# EAGLE design cc2650_48 (EAGLE 8.3.2)
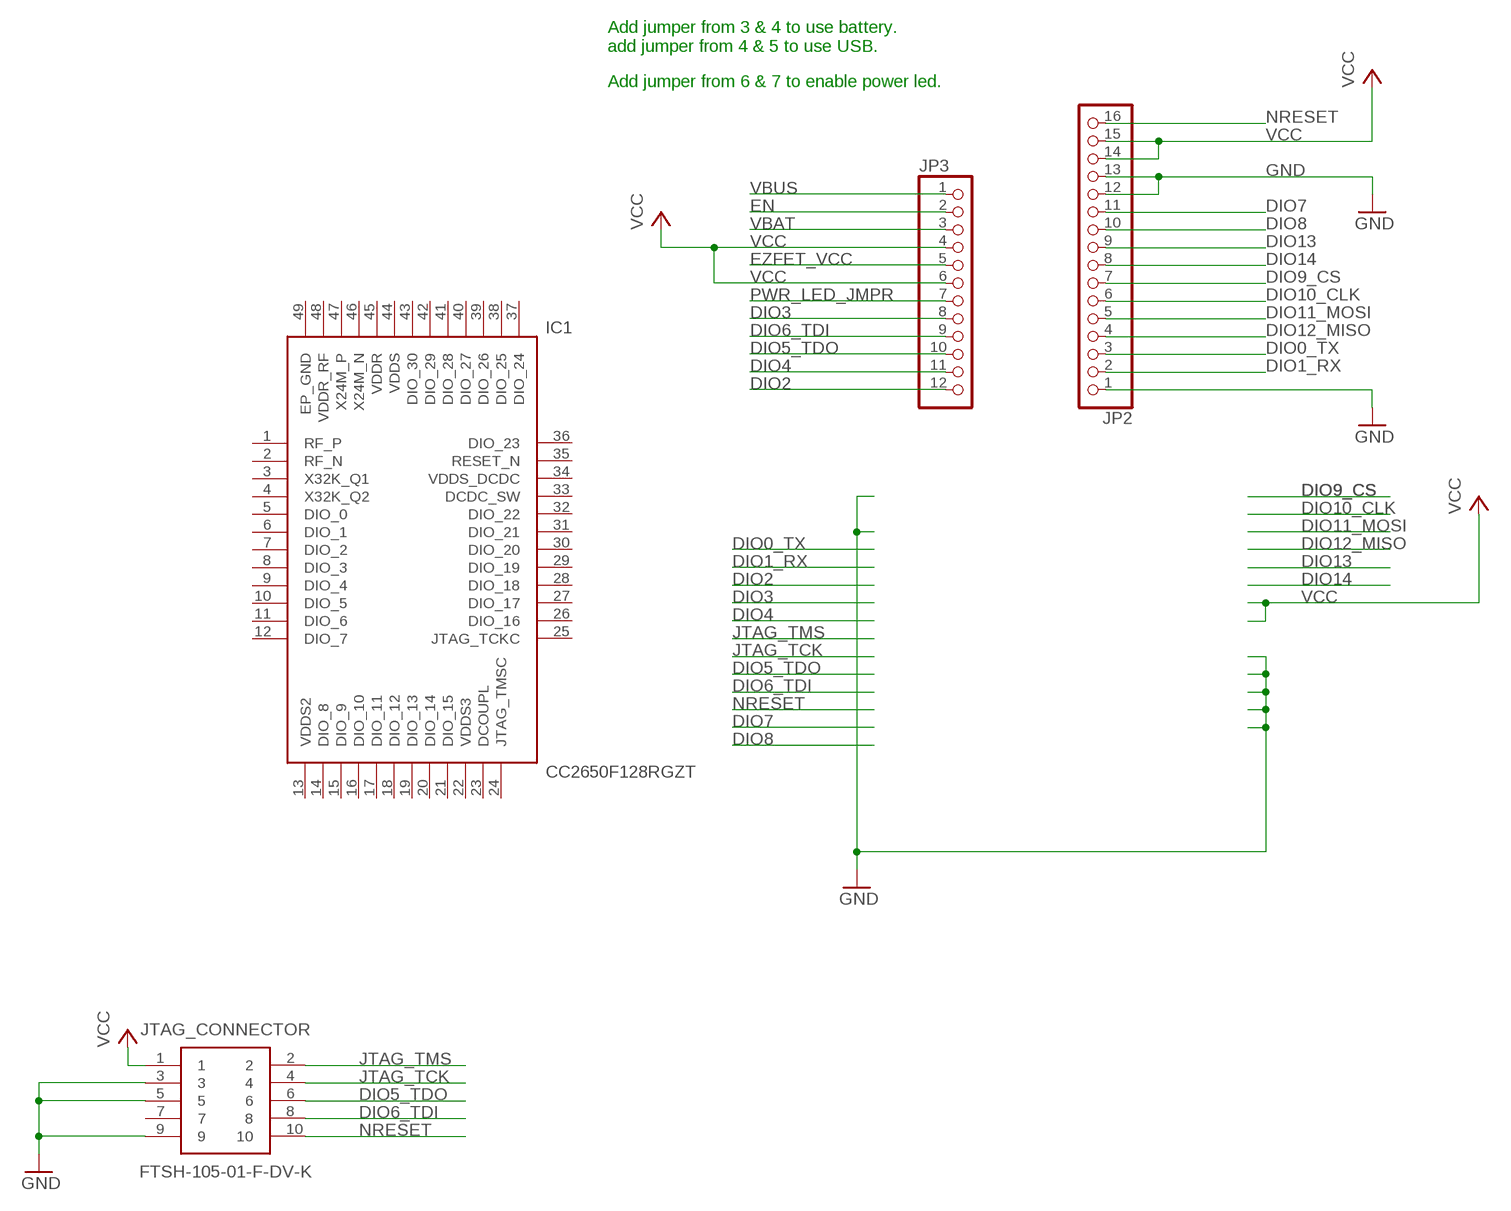
[diagram p0: schematic, sheet 1, part 1 of 2]
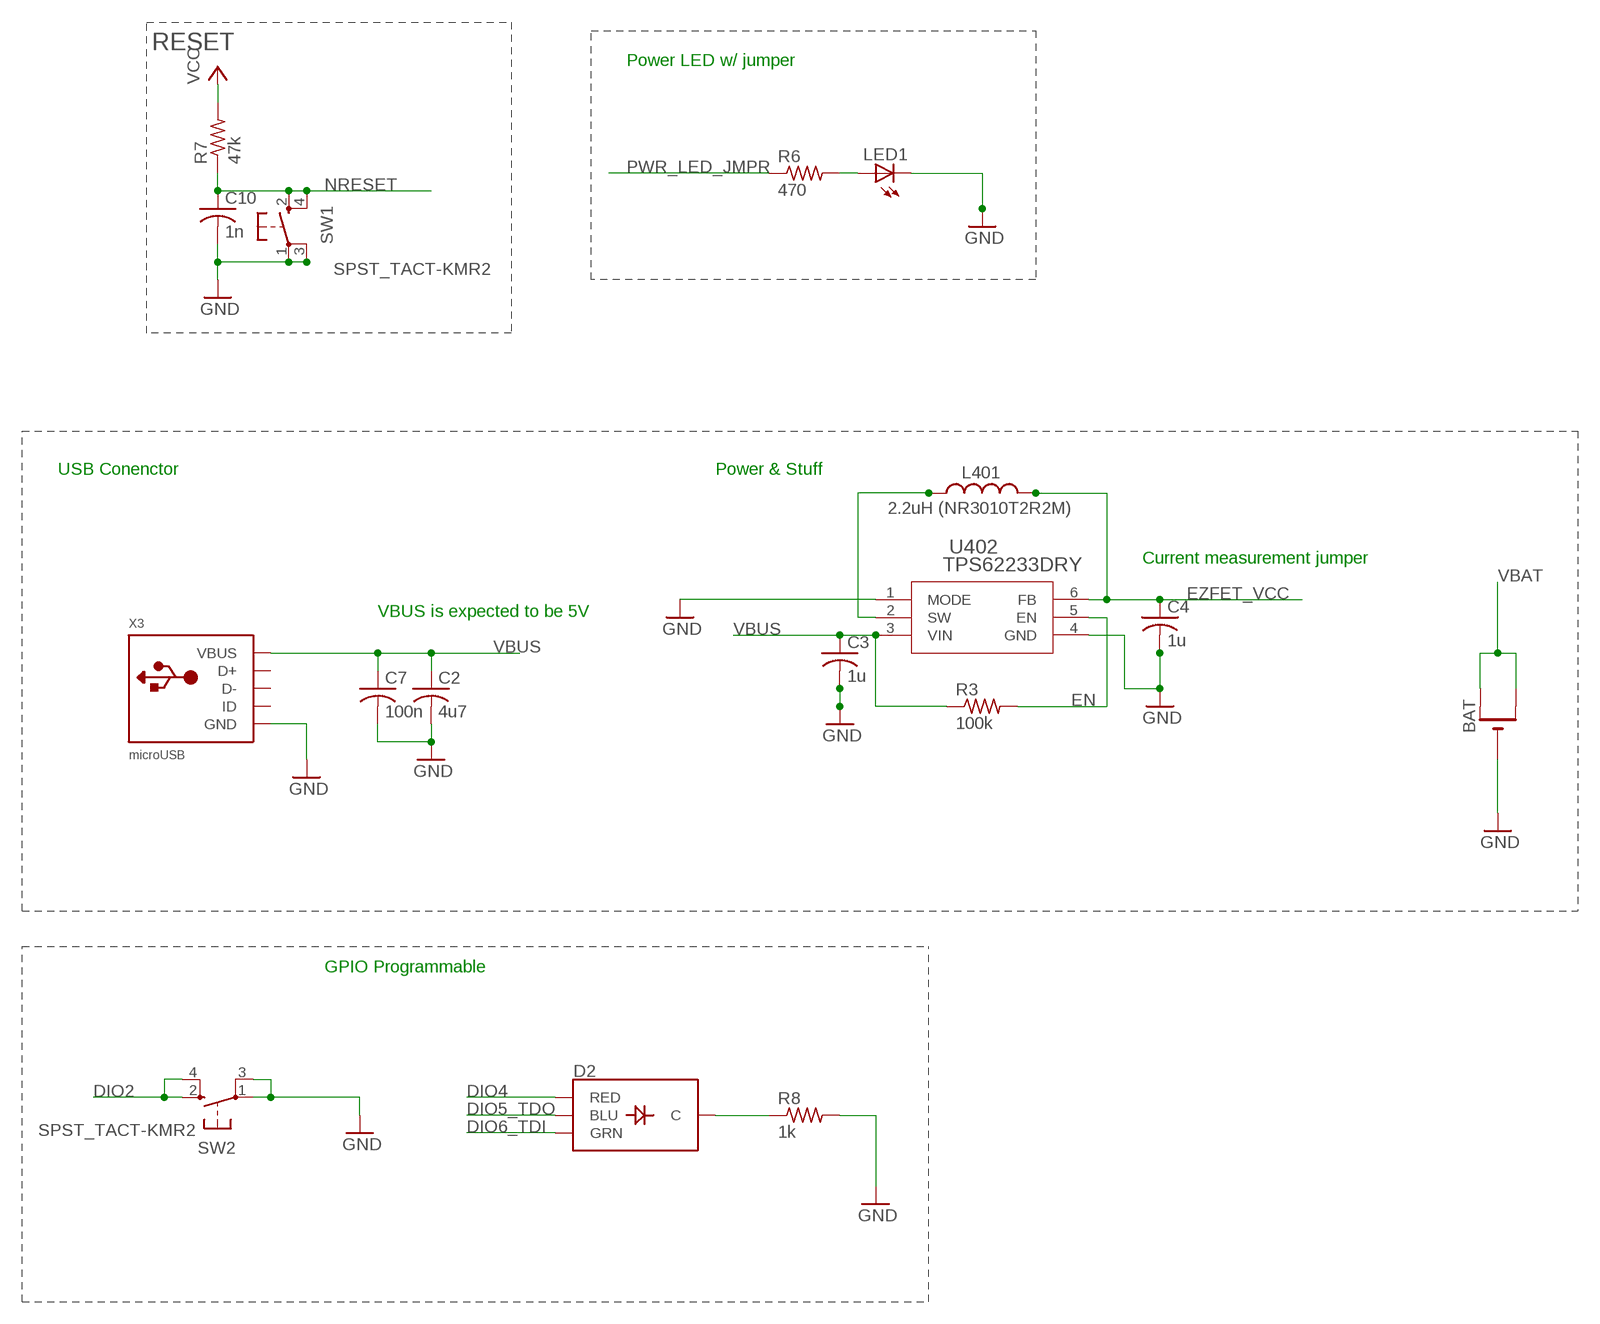
[diagram p1: schematic, sheet 1, part 2 of 2]

## Parts
BAT  CR1220THM  [CR1220-THM]
C2  4u7  C-USC1206  [C1206]
C3  1u  C-USC0805  [C0805]
C4  1u  C-USC0805  [C0805]
C7  100n  C-USC0805  [C0805]
C10  1n  C-USC0805  [C0805]
D2  LED-RGB-CCPIRANHA  [LED_PIRANHA_5MM]
IC1  CC2650F128RGZT  [QFN50P700X700X100-49N]
JP2  HEADER-1X16ROUND  [1X16_ROUND]
JP3  HEADER-1X12  [1X12_ROUND]
JTAG_CONNECTOR  FTSH-105-01-F-DV-K  [SAMTEC_FTSH-105-01-L-DV]
L401  2.2uH (NR3010T2R2M)  L-NR3010  [L-NR3010]
LED1  LEDCHIPLED_0805  [CHIPLED_0805]
R3  100k  R-US_R0805  [R0805]
R6  470  R-US_R0805  [R0805]
R7  47k  R-US_R0805  [R0805]
R8  1k  R-US_R0805  [R0805]
SW1  SPST_TACT-KMR2  [KMR2]
SW2  SPST_TACT-KMR2  [KMR2]
U402  TPS62233DRY  TPS6223X_DRY_6  [DRY6]
X3  microUSB  USB_MICRO_20329_V2  [4UCONN_20329_V2]

## Nets
DIO0_TX: JP2.3
DIO1_RX: JP2.2
DIO2: JP3.12 SW2.2(S) SW2.4(S1)
DIO3: JP3.8
DIO4: D2.R(RED) JP3.11
DIO5_TDO: D2.B(BLU) JP3.10 JTAG_CONNECTOR.6
DIO6_TDI: D2.G(GRN) JP3.9 JTAG_CONNECTOR.8
DIO7: JP2.11
DIO8: JP2.10
DIO9_CS: JP2.7
DIO10_CLK: JP2.6
DIO11_MOSI: JP2.5
DIO12_MISO: JP2.4
DIO13: JP2.9
DIO14: JP2.8
EN: JP3.2 R3.2 U402.5(EN)
EZFET_VCC: C4.1 JP3.5 L401.P$2 U402.6(FB)
GND: BAT.- C2.2 C3.2 C4.2 C7.2 C10.2 JP2.1 JP2.12 JP2.13 JTAG_CONNECTOR.3 JTAG_CONNECTOR.5 JTAG_CONNECTOR.9 LED1.C R8.2 SW1.1(P) SW1.3(P1) SW2.1(P) SW2.3(P1) U402.1(MODE) U402.4(GND) X3.BASE@1(GND) X3.BASE@2(GND) X3.GND X3.SPRT@1(GND) X3.SPRT@2(GND) X3.SPRT@3(GND) X3.SPRT@4(GND)
JTAG_TCK: JTAG_CONNECTOR.4
JTAG_TMS: JTAG_CONNECTOR.2
N$2: D2.-(C) R8.1
N$14: L401.P$1 U402.2(SW)
N$32: LED1.A R6.2
NRESET: C10.1 JP2.16 JTAG_CONNECTOR.10 R7.1 SW1.2(S) SW1.4(S1)
PWR_LED_JMPR: JP3.7 R6.1
VBAT: BAT.+1(+) BAT.+2(+1) JP3.3
VBUS [Power]: C2.1 C3.1 C7.1 JP3.1 R3.1 U402.3(VIN) X3.VBUS
VCC: JP2.14 JP2.15 JP3.4 JP3.6 JTAG_CONNECTOR.1 R7.2
Unconnected: IC1.1(RF_P) IC1.2(RF_N) IC1.3(X32K_Q1) IC1.4(X32K_Q2) IC1.5(DIO_0) IC1.6(DIO_1) IC1.7(DIO_2) IC1.8(DIO_3) IC1.9(DIO_4) IC1.10(DIO_5) IC1.11(DIO_6) IC1.12(DIO_7) IC1.14(DIO_8) IC1.15(DIO_9) IC1.16(DIO_10) IC1.17(DIO_11) IC1.18(DIO_12) IC1.19(DIO_13) IC1.20(DIO_14) IC1.21(DIO_15) IC1.23(DCOUPL) IC1.24(JTAG_TMSC) IC1.25(JTAG_TCKC) IC1.26(DIO_16) IC1.27(DIO_17) IC1.28(DIO_18) IC1.29(DIO_19) IC1.30(DIO_20) IC1.31(DIO_21) IC1.32(DIO_22) IC1.33(DCDC_SW) IC1.35(RESET_N) IC1.36(DIO_23) IC1.37(DIO_24) IC1.38(DIO_25) IC1.39(DIO_26) IC1.40(DIO_27) IC1.41(DIO_28) IC1.42(DIO_29) IC1.43(DIO_30) IC1.46(X24M_N) IC1.47(X24M_P) JTAG_CONNECTOR.7 X3.D+ X3.D- X3.ID

## Notes on the sheet
- RESET
- Power LED w/ jumper
- Add jumper from 3 & 4 to use battery.
  add jumper from 4 & 5 to use USB.
- Add jumper from 6 & 7 to enable power led.
- USB Conenctor | Power & Stuff
- Current measurement jumper
- VBUS is expected to be 5V
- GPIO Programmable

## Power pins joined to a net without a drawn wire
EP_GND: IC1.49(EP_GND)
VDDR: IC1.45(VDDR)
VDDR_RF: IC1.48(VDDR_RF)
VDDS: IC1.44(VDDS)
VDDS2: IC1.13(VDDS2)
VDDS3: IC1.22(VDDS3)
VDDS_DCDC: IC1.34(VDDS_DCDC)

## Library data of the parts
BAT = adafruit:CR1220: CR1216/CR1220/CR1225 12mm 3V lithium coin cell Great for battery packup. Both SMT and THM holders. Note the THM package has the ground pads on both sides of the PCB so that the masks are the same - this reduces the cost; MF: KEYSTONE ELECTR; MPN: 3000; OC_NEWARK: 66F5622
C2 = adafruit:C-US: CAPACITOR, American symbol; MPN: GRT31CC81E475KE01L; OC_NEWARK: 01AC8998
C3 C4 = adafruit:C-US: CAPACITOR, American symbol; MPN: C0805C105K5RACTU; OC_NEWARK: 05AC8016
C7 C10 = adafruit:C-US: CAPACITOR, American symbol
D2 = SparkFun-LED:LED-RGB-CC: LED-RGB Common Cathode Packages: LED RGB-THRU LED_PIRANHA_5MM SparkFun Products: RGB Diffused Common Cathode- Diffuse <[https://www.sparkfun.com/products/9264]> RGB Diffused Common Cathode - Clear <[https://www.sparkfun.com/products/105]> LED-RGB 5mm Square (Piranha) <[https://www.sparkfun.com/products/11679]>; MPN: CLMVB-FKA-CFHEHLCBB7A363; OC_NEWARK: 11X6434; SF_ID: COM-11679
IC1 = CC2650F128RGZT:CC2650F128RGZT: MCU 32-bit 128KB Flash 20K RAM VQFN48 Texas Instruments CC2650F128RGZT, 32bit ARM Cortex M3 Microcontroller, 48MHz, 128 kB Flash, 48-Pin VQFN <https://componentsearchengine.com/Images/1/CC2650F128RGZT.jpg> Source: Datasheet <http://www.ti.com/lit/ds/symlink/cc2650.pdf>; DESCRIPTION: MCU 32-bit 128KB Flash 20K RAM VQFN48 Texas Instruments CC2650F128RGZT, 32bit ARM Cortex M3 Microcontroller, 48MHz, 128 kB Flash, 48-Pin VQFN; HEIGHT: 1mm; MANUFACTURER_NAME: Texas Instruments; MANUFACTURER_PART_NUMBER: CC2650F128RGZT; RS_PART_NUMBER: 8751012P; SUPPLIER_NAME: RS
JP2 = microbuilder:HEADER-1X16: PIN HEADER; OC_NEWARK: unknown
JP3 = microbuilder:HEADER-1X12; OC_NEWARK: unknown
JTAG_CONNECTOR = FTSH-105-01-F-DV-K:FTSH-105-01-F-DV-K: .050 x .050 CL DOUBLE VERTICAL SMT TERMINAL STRIP <https://componentsearchengine.com/Images/9/FTSH-105-01-F-DV-K.jpg> Source: Datasheet <http://suddendocs.samtec.com/prints/ftsh-1xx-xx-xxx-dv-xxx-xxx-mkt.pdf>; DESCRIPTION: .050 x .050 CL DOUBLE VERTICAL SMT TERMINAL STRIP; HEIGHT: mm; MANUFACTURER_NAME: SAMTEC; MANUFACTURER_PART_NUMBER: FTSH-105-01-F-DV-K; MPN: FTSH-105-01-F-DV-K; OC_NEWARK: 45P5160; SUPPLIER_NAME: RS
L401 = MSP-EXP430F5659:L-NR3010; MPN: NR3010T2R2M; OC_NEWARK: 87K4752
LED1 = led:LED: LED OSRAM: - CHIPLED LG R971, LG N971, LY N971, LG Q971, LY Q971, LO R971, LY R971 LH N974, LH R974 LS Q976, LO Q976, LY Q976 LO Q996 - Hyper CHIPLED LW Q18S LB Q993, LB Q99A, LB R99A - SideLED LS A670, LO A670, LY A670, LG A670, LP A670 LB A673, LV A673, LT A673, LW A673 LH A674 LY A675 LS A676, LA A676, LO A676, LY A676, LW A676 LS A679, LY A679, LG A679 - Hyper Micro SIDELED® LS Y876, LA Y876, LO Y876, LY Y876 LT Y87S - SmartLED LW L88C, LW L88S LB L89C, LB L89S, LG L890 LS L89K, LO L89K, LY L89K LS L896, LA L896, LO L896, LY L896 - TOPLED LS T670, LO T670, LY T670, LG T670, LP T670 LSG T670, LSP T670, LSY T670, LOP T670, LYG T670 LG T671, LOG T671, LSG T671 LB T673, LV T673, LT T673, LW T673 LH T674 LS T676, LA T676, LO T676, LY T676, LB T676, LH T676, LSB T676, LW T676 LB T67C, LV T67C, LT T67C, LS T67K, LO T67K, LY T67K, LW E67C LS E67B, LA E67B, LO E67B, LY E67B, LB E67C, LV E67C, LT E67C LW T67C LS T679, LY T679, LG T679 LS T770, LO T770, LY T770, LG T770, LP T770 LB T773, LV T773, LT T773, LW T773 LH T774 LS E675, LA E675, LY E675, LS T675 LS T776, LA T776, LO T776, LY T776, LB T776 LHGB T686 LT T68C, LB T68C - Hyper Mini TOPLED® LB M676 - Mini TOPLED Santana® LG M470 LS M47K, LO M47K, LY M47K Source: http://www.osram.convergy.de LUXEON: - LUMILED® LXK2-PW12-R00, LXK2-PW12-S00, LXK2-PW14-U00, LXK2-PW14-V00 LXK2-PM12-R00, LXK2-PM12-S00, LXK2-PM14-U00 LXK2-PE12-Q00, LXK2-PE12-R00, LXK2-PE12-S00, LXK2-PE14-T00, LXK2-PE14-U00 LXK2-PB12-K00, LXK2-PB12-L00, LXK2-PB12-M00, LXK2-PB14-N00, LXK2-PB14-P00, LXK2-PB14-Q00 LXK2-PR12-L00, LXK2-PR12-M00, LXK2-PR14-Q00, LXK2-PR14-R00 LXK2-PD12-Q00, LXK2-PD12-R00, LXK2-PD12-S00 LXK2-PH12-R00, LXK2-PH12-S00 LXK2-PL12-P00, LXK2-PL12-Q00, LXK2-PL12-R00 Source: www.luxeon.com KINGBRIGHT: KA-3528ASYC Source: www.kingbright.com
R3 R6-R8 = adafruit:R-US_: RESISTOR, American symbol
SW1 SW2 = adafruit:SPST_TACT: SMT 6mm switch, EVQQ2 series http://www.ladyada.net/library/eagle; OC_NEWARK: unknown
U402 = tps62231dry:TPS6223X_DRY_6; DATASHEETURL: http://www.ti.com/lit/gpn/TPS62231; DESCRIPTION: 3 MHz Ultra Small Step Down Converter in 1x1.5 SON Package; FAMILY_NAME: STEP-DOWN REGULATOR; GENERIC_PART_NUMBER: TPS62231; INDUSTRY_STD_PKG_TYPE: SON; MANUFACTURER: Texas Instruments; MANUFACTURER_PART_NUMBER: tps62231_dry_6; MPN: TPS62233DRYT; OC_NEWARK: 37X8886; PACKAGE_DESIGNATOR: DRY; PIN_COUNT: 6; VALUE: TPS6223xDRY; VENDOR: Texas Instuments
X3 = microbuilder:USB: USB Connectors USBMINIB - Surface Mount Female Mini-B USB Connector 4UConnector: 06564

## Net classes
0 Default: width 0.203 mm, drill 0.305 mm, clearance 0.152 mm
1 Ground: width 0.203 mm, drill 0.305 mm, clearance 0.152 mm to class 0, clearance 0.152 mm
2 Power: width 0.203 mm, drill 0.305 mm, clearance 0.152 mm to class 0, clearance 0.152 mm to class 1, clearance 0.152 mm

## Board
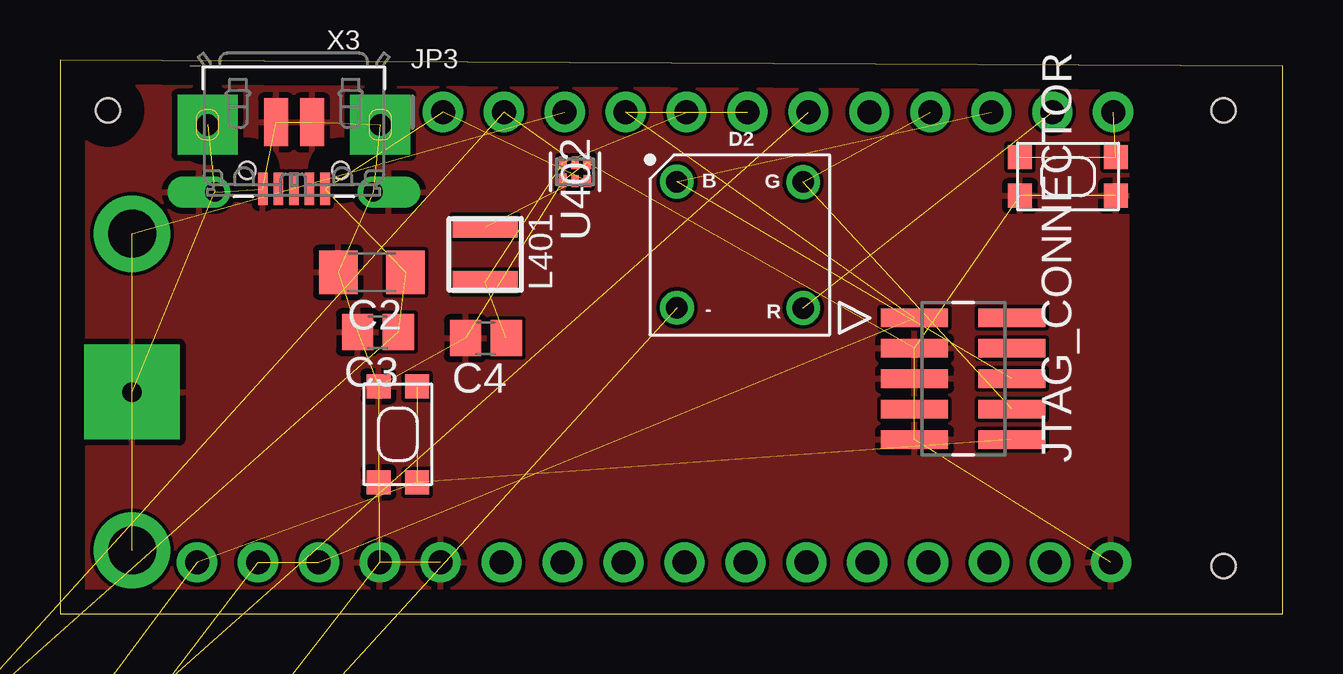
[diagram p2: board, top side]
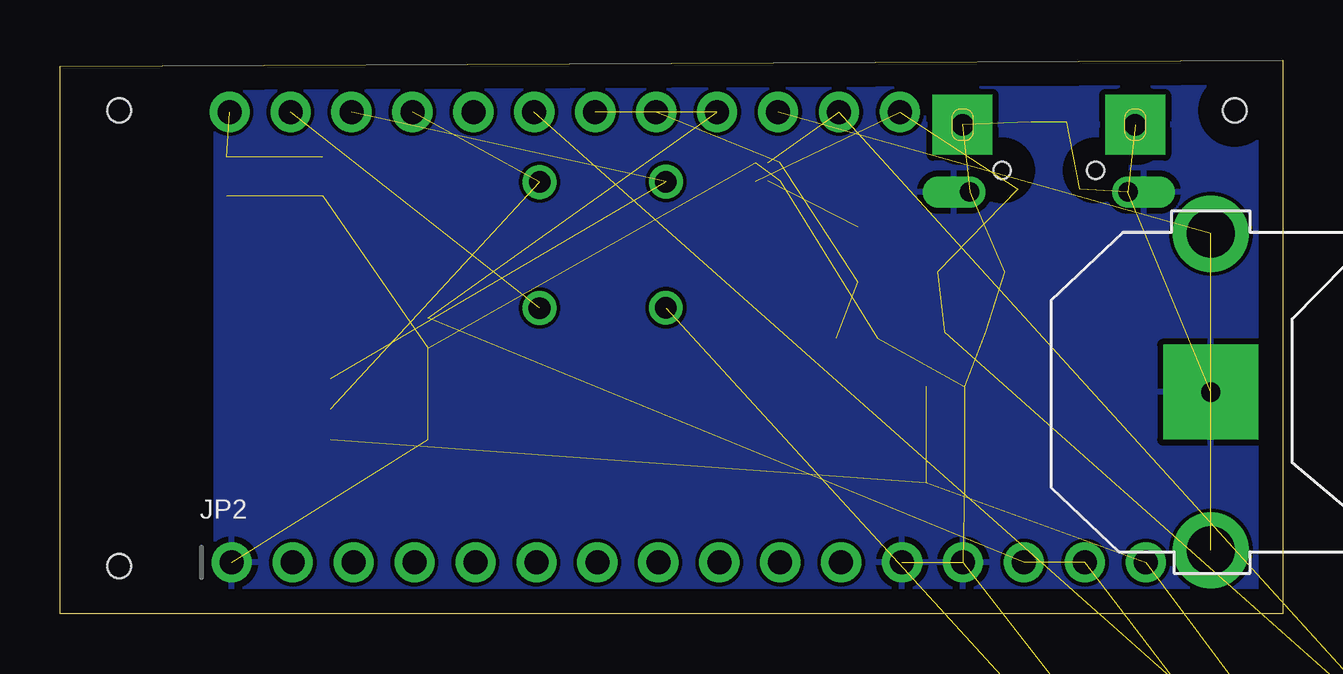
[diagram p3: board, bottom side, seen from below]

Size 50.97 x 23.1 mm. Coordinates in mm from the lower left corner, seen from the top.
Outline: 0,0 50.97,0 50.97,22.85 0,23.1 0,0
Copper layers (1*16): Top 0.035mm / dielectric 1.5mm / Bottom 0.035mm
Design rules "default": minimum track width 6mil, minimum drill 0.35mm, track to track 6mil, track to pad 6mil, pad to pad 6mil, via to via 6mil, smd to smd 6mil, copper to edge 40mil, drill to drill 6mil, minimum pad ring 10mil, minimum via ring 8mil, stop-mask expansion 4mil, vias tented up to drill 0mil, thermal gap 10mil
Holes 1 mm at 48.5,2 48.5,21 2,21

### Footprints (pad centres in the part's own frame; a part is rotated, then mirrored left to right if it is on the bottom)
CR1220-THM = drill 2 pad 3.175: +1 -6.604,0; +2 6.604,0 | drill 0.8 pad 3.962 square: - 0,0
C1206 = smd 1.6 x 1.8: 1 -1.4,0; 2 1.4,0
C0805 = smd 1.3 x 1.5: 1 -0.85,0; 2 0.85,0
LED_PIRANHA_5MM = drill 0.9: - -2.684,-2.684; B -2.688,2.574; G 2.575,2.562; R 2.579,-2.696
QFN50P700X700X100-49N = smd 0.8 x 0.3: 1 -3.5,2.75; 2 -3.5,2.25; 3 -3.5,1.75; 4 -3.5,1.25; 5 -3.5,0.75; 6 -3.5,0.25; 7 -3.5,-0.25; 8 -3.5,-0.75; 9 -3.5,-1.25; 10 -3.5,-1.75; 11 -3.5,-2.25; 12 -3.5,-2.75; 25 3.5,-2.75; 26 3.5,-2.25; 27 3.5,-1.75; 28 3.5,-1.25; 29 3.5,-0.75; 30 3.5,-0.25; 31 3.5,0.25; 32 3.5,0.75; 33 3.5,1.25; 34 3.5,1.75; 35 3.5,2.25; 36 3.5,2.75 | smd 0.3 x 0.8: 13 -2.75,-3.5; 14 -2.25,-3.5; 15 -1.75,-3.5; 16 -1.25,-3.5; 17 -0.75,-3.5; 18 -0.25,-3.5; 19 0.25,-3.5; 20 0.75,-3.5; 21 1.25,-3.5; 22 1.75,-3.5; 23 2.25,-3.5; 24 2.75,-3.5; 37 2.75,3.5; 38 2.25,3.5; 39 1.75,3.5; 40 1.25,3.5; 41 0.75,3.5; 42 0.25,3.5; 43 -0.25,3.5; 44 -0.75,3.5; 45 -1.25,3.5; 46 -1.75,3.5; 47 -2.25,3.5; 48 -2.75,3.5 | smd 5.25 x 5.25: 49 0,0
1X16_ROUND = drill 1 pad 1.676: 1 -19.05,0; 2 -16.51,0; 3 -13.97,0; 4 -11.43,0; 5 -8.89,0; 6 -6.35,0; 7 -3.81,0; 8 -1.27,0; 9 1.27,0; 10 3.81,0; 11 6.35,0; 12 8.89,0; 13 11.43,0; 14 13.97,0; 15 16.51,0; 16 19.05,0
1X12_ROUND = drill 1 pad 1.676: 1 -13.97,0; 2 -11.43,0; 3 -8.89,0; 4 -6.35,0; 5 -3.81,0; 6 -1.27,0; 7 1.27,0; 8 3.81,0; 9 6.35,0; 10 8.89,0; 11 11.43,0; 12 13.97,0
SAMTEC_FTSH-105-01-L-DV = smd 0.762 x 2.794: 1 -2.54,-2.032; 2 -2.54,2.032; 3 -1.27,-2.032; 4 -1.27,2.032; 5 0,-2.032; 6 0,2.032; 7 1.27,-2.032; 8 1.27,2.032; 9 2.54,-2.032; 10 2.54,2.032
L-NR3010 = smd 0.9 x 2.7: P$1 -1.15,0; P$2 1.15,0
CHIPLED_0805 = smd 1.2 x 1.2: A 0,-1.05; C 0,1.05
R0805 = smd 1.1 x 1.4: 1 -1,0; 2 1,0
KMR2 = smd 1 x 1: 1 2,0.8; 2 2,-0.8; 3 -2,0.8; 4 -2,-0.8
DRY6 = smd 0.559 x 0.305: 1 -0.356,0.508 | smd 0.508 x 0.305: 2 -0.381,0; 3 -0.381,-0.508; 4 0.381,-0.508; 5 0.381,0; 6 0.381,0.508
4UCONN_20329_V2 = smd 1 x 2: BASE@1 -0.75,-2; BASE@2 0.75,-2 | smd 0.4 x 1.35: D+ 0,0.775; D- -0.65,0.775; GND 1.3,0.775; ID 0.65,0.775; VBUS -1.3,0.775 | drill 0.8 pad 1.2 offset: SPRT@1 -3.3,0.9; SPRT@2 3.3,0.9 | drill 0.9 pad 2.5 square: SPRT@3 -3.6,-1.9; SPRT@4 3.6,-1.9 | hole 0.7: -1.95,0; 1.95,0

### Placement (x,y rotation side)
BAT  3,9.25 270 bottom
C2  13,14.25 180 top
C3  13.25,11.75 180 top
C4  17.75,11.5 180 top
C7  -15,-45 0 top  (outside the outline)
C10  -15,-63 0 top  (outside the outline)
D2  28.4,15.45 0 top
IC1  -22,-57 0 top  (outside the outline)
JP2  24.76,2.15 0 bottom
JP3  29.93,20.93 0 top
JTAG_CONNECTOR  37.65,9.81 270 top
L401  17.72,14.99 270 top
LED1  -30,-64 0 top  (outside the outline)
R3  -15,-15 0 top  (outside the outline)
R6  -15,-21 0 top  (outside the outline)
R7  -15,-27 0 top  (outside the outline)
R8  -15,-33 0 top  (outside the outline)
SW1  14.08,7.49 90 top
SW2  42.02,18.24 180 top
U402  21.47,18.43 90 top
X3  9.75,18.5 180 top

### Tracks (layer width: path | path; a pad name or v marks a point on that pad's centre or on a via)
DIO2  (2 unrouted)
DIO4  (1 unrouted)
DIO5_TDO  (2 unrouted)
DIO6_TDI  (2 unrouted)
EN  (2 unrouted)
EZFET_VCC  (3 unrouted)
GND  (26 unrouted)
  pour Bottom: 0,23 44.5,23 44.5,0 0,0
  pour Top: 0,23 44.5,23 44.5,0 0,0
N$2  (1 unrouted)
N$14  (1 unrouted)
N$32  (1 unrouted)
NRESET  (5 unrouted)
PWR_LED_JMPR  (1 unrouted)
VBAT  (2 unrouted)
VBUS  (6 unrouted)
VCC  (5 unrouted)